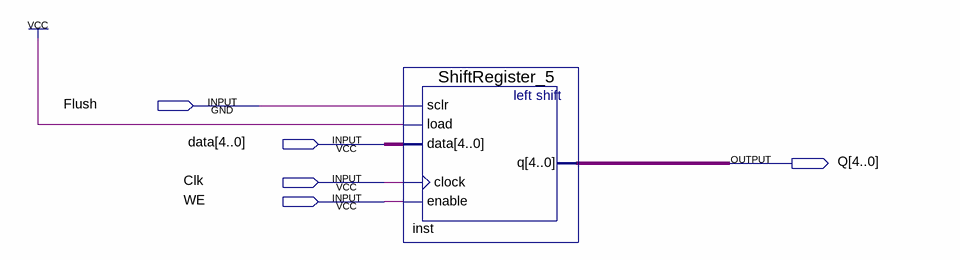
[diagram p0: schematic sheet]
// Quartus schematic ShiftRegister5.bdf as structural Verilog: 1 symbols, 5 pins
module ShiftRegister5 (
  input  Flush,
  input  [4:0] data,
  input  Clk,
  input  WE,
  output [4:0] Q
);

  ShiftRegister_5 inst (.sclr(Flush), .load(1'b1), .data(data), .clock(Clk), .enable(WE), .q(Q));
endmodule
